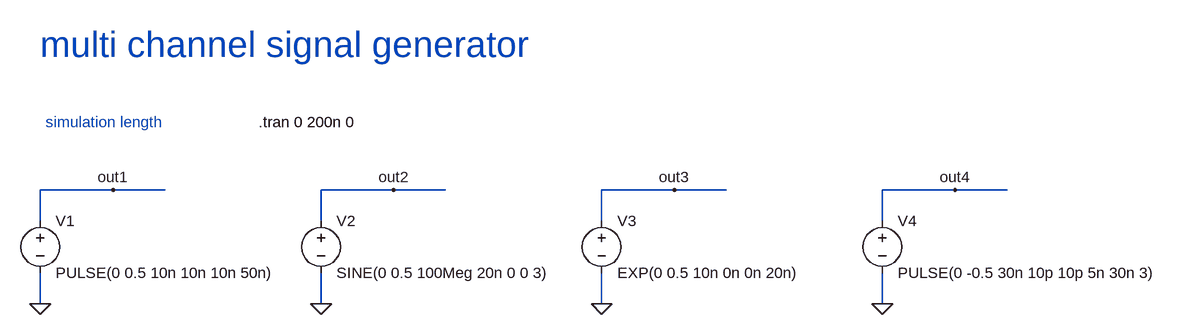
[diagram p0: schematic example_multichan.asc]
example_multichan.asc, the LTspice schematic file:
Version 4
SHEET 1 880 19840
WIRE -7072 1760 -7184 1760
WIRE -6992 1760 -7072 1760
WIRE -6640 1760 -6752 1760
WIRE -6560 1760 -6640 1760
WIRE -6208 1760 -6320 1760
WIRE -6128 1760 -6208 1760
WIRE -5776 1760 -5888 1760
WIRE -5696 1760 -5776 1760
WIRE -7184 1808 -7184 1760
WIRE -6752 1808 -6752 1760
WIRE -6320 1808 -6320 1760
WIRE -5888 1808 -5888 1760
WIRE -7184 1936 -7184 1888
WIRE -6752 1936 -6752 1888
WIRE -6320 1936 -6320 1888
WIRE -5888 1936 -5888 1888
FLAG -7184 1936 0
FLAG -7072 1760 out1
FLAG -6752 1936 0
FLAG -6640 1760 out2
FLAG -6320 1936 0
FLAG -6208 1760 out3
FLAG -5888 1936 0
FLAG -5776 1760 out4
SYMBOL voltage -7184 1792 R0
WINDOW 123 0 0 Left 0
WINDOW 39 0 0 Left 0
SYMATTR InstName V1
SYMATTR Value PULSE(0 0.5 10n 10n 10n 50n)
SYMBOL voltage -6752 1792 R0
WINDOW 123 0 0 Left 0
WINDOW 39 0 0 Left 0
SYMATTR InstName V2
SYMATTR Value SINE(0 0.5 100Meg 20n 0 0 3)
SYMBOL voltage -6320 1792 R0
WINDOW 123 0 0 Left 0
WINDOW 39 0 0 Left 0
SYMATTR InstName V3
SYMATTR Value EXP(0 0.5 10n 0n 0n 20n)
SYMBOL voltage -5888 1792 R0
WINDOW 123 0 0 Left 0
WINDOW 39 0 0 Left 0
SYMATTR InstName V4
SYMATTR Value PULSE(0 -0.5 30n 10p 10p 5n 30n 3)
TEXT -6848 1656 Left 2 !.tran 0 200n 0
TEXT -7184 1536 Left 5 ;multi channel signal generator
TEXT -7176 1656 Left 2 ;simulation length

The netlist it stands for:
* example_multichan.asc
V1 out1 0 PULSE(0 0.5 10n 10n 10n 50n)
V2 out2 0 SINE(0 0.5 100Meg 20n 0 0 3)
V3 out3 0 EXP(0 0.5 10n 0n 0n 20n)
V4 out4 0 PULSE(0 -0.5 30n 10p 10p 5n 30n 3)
.tran 0 200n 0
* multi channel signal generator
* simulation length
.backanno
.end